# EAGLE schematic Main Board (EAGLE 8.4.1)

## Sheet 1 of 2
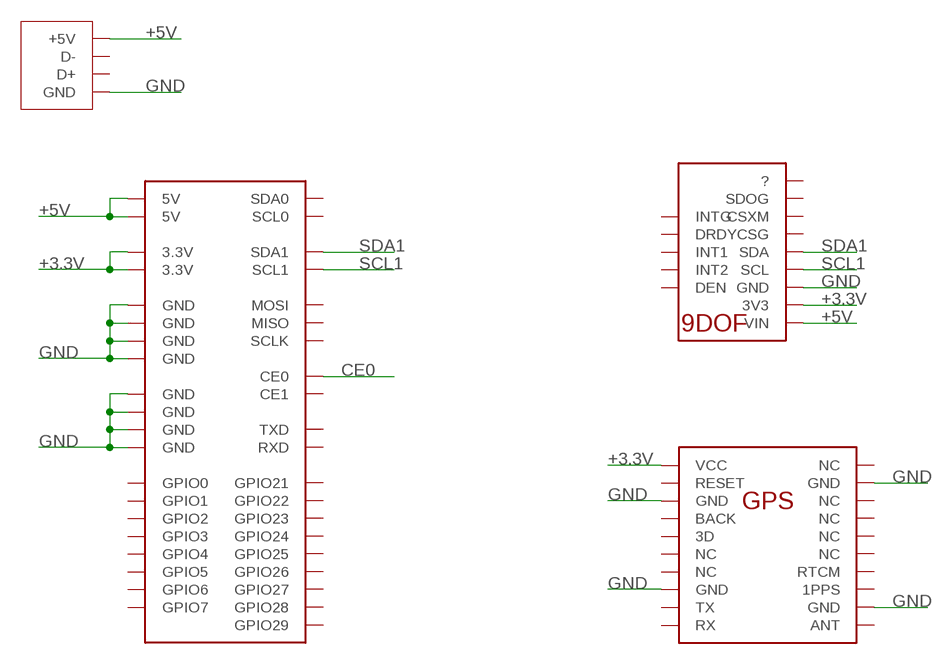
[diagram p0: schematic, sheet 1]

### Parts
U$5  GPS  [GPS]
U$6  9DOF  [9DOF]
U$8  USB_VERTICLE  [USB_VERTICLE]
U$11  PI  [PI_HEADER_SMD]

### Nets
+3.3V: U$5.P$1(VCC) U$6.P$21(3V3) U$11.3.3V@1(3.3V) U$11.3.3V@17(3.3V)
+5V: U$6.P$20(VIN) U$8.VCC(+5V) U$11.5V@2(5V) U$11.5V@4(5V)
CE0: U$11.CE0
GND: U$5.P$3(GND) U$5.P$8(GND) U$5.P$12(GND) U$5.P$19(GND) U$6.P$22(GND) U$8.GND@1(GND) U$8.GND@2(GND) U$8.GND@3(GND) U$11.GND@6(GND) U$11.GND@9(GND) U$11.GND@14(GND) U$11.GND@20(GND) U$11.GND@25(GND) U$11.GND@30(GND) U$11.GND@34(GND) U$11.GND@39(GND)
SCL1: U$6.P$23(SCL) U$11.SCL1
SDA1: U$6.P$24(SDA) U$11.SDA1
Unconnected: U$5.P$2(RESET) U$5.P$4(BACK) U$5.P$5(3D) U$5.P$6(NC) U$5.P$7(NC) U$5.P$9(TX) U$5.P$10(RX) U$5.P$11(ANT) U$5.P$13(1PPS) U$5.P$14(RTCM) U$5.P$15(NC) U$5.P$16(NC) U$5.P$17(NC) U$5.P$18(NC) U$5.P$20(NC) U$6.P$15(DEN) U$6.P$16(INT2) U$6.P$17(INT1) U$6.P$18(DRDY) U$6.P$19(INTG) U$6.P$25(CSG) U$6.P$26(CSXM) U$6.P$27(SDOG) U$6.P$28(?) U$8.D+ U$8.D- U$11.CE1 U$11.GPIO0 U$11.GPIO1 U$11.GPIO2 U$11.GPIO3 U$11.GPIO4 U$11.GPIO5 U$11.GPIO6 U$11.GPIO7 U$11.GPIO21 U$11.GPIO22 U$11.GPIO23 U$11.GPIO24 U$11.GPIO25 U$11.GPIO26 U$11.GPIO27 U$11.GPIO28 U$11.GPIO29 U$11.MISO U$11.MOSI U$11.RXD U$11.SCL0 U$11.SCLK U$11.SDA0 U$11.TXD

## Sheet 2 of 2

## Library data of the parts
U$5 = GoatFinder:GPS
U$6 = GoatFinder:9DOF
U$8 = GoatFinder:USB_VERTICLE
U$11 = GoatFinder:PI